# EAGLE design IR (EAGLE 9.6.2)
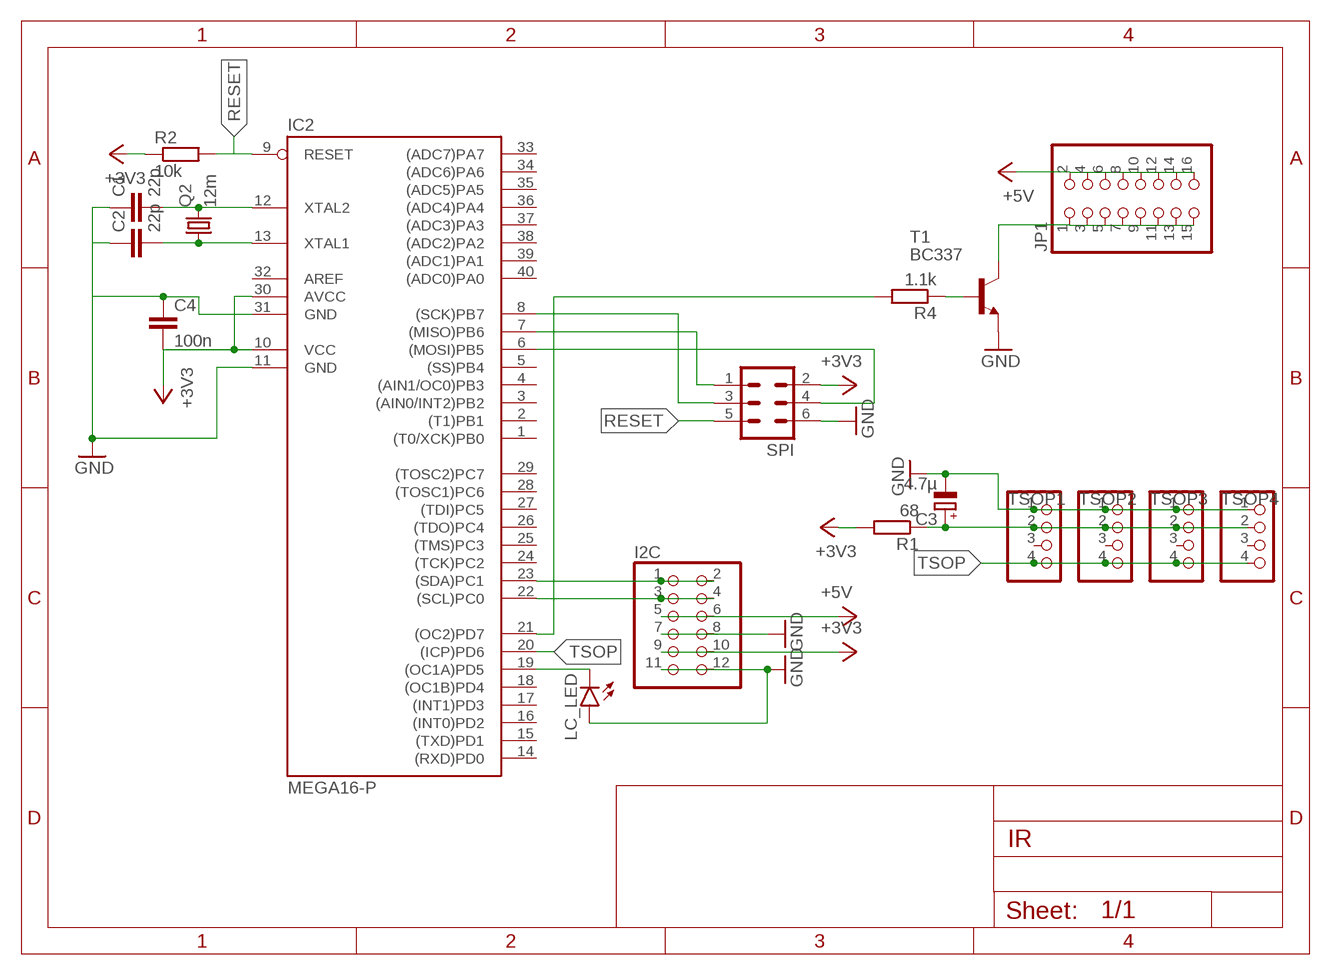
[diagram p0: schematic, sheet 1]

## Parts
C1  22p  C-EU025-025X050  [C025-025X050]
C2  22p  C-EU025-025X050  [C025-025X050]
C3  4.7µ  CPOL-EUE1.8-4  [E1,8-4]
C4  100n  C-EU025-025X050  [C025-025X050]
I2C  PINHD-2X6  [2X06]
IC2  MEGA16-P  [DIL40]
JP1  PINHD-2X8  [2X08]
LC_LED  LED5MM  [LED5MM]
Q2  12m  CRYSTALHC49S  [HC49/S]
R1  68  R-EU_0207/7  [0207/7]
R2  10k  R-EU_0207/7  [0207/7]
R4  1.1k  R-EU_0207/7  [0207/7]
SPI  ML6  [ML6]
T1  BC337  [TO92]
TSOP1  PINHD-1X4  [1X04]
TSOP2  PINHD-1X4  [1X04]
TSOP3  PINHD-1X4  [1X04]
TSOP4  PINHD-1X4  [1X04]

## Nets
+3V3: C4.2 I2C.9 I2C.10 IC2.10(VCC) IC2.30(AVCC) R1.2 R2.1 SPI.2
+5V: I2C.5 I2C.6 JP1.2 JP1.4 JP1.6 JP1.8 JP1.10 JP1.12 JP1.14 JP1.16
GND: C1.1 C2.1 C3.- C4.1 I2C.7 I2C.8 I2C.11 I2C.12 IC2.11(GND) IC2.31(GND) LC_LED.A SPI.6 T1.1(E) TSOP1.1 TSOP2.1 TSOP3.1 TSOP4.1
IO13: IC2.7((MISO)PB6) SPI.1
IO14: IC2.6((MOSI)PB5) SPI.4
N$1: C2.2 IC2.13(XTAL1) Q2.1
N$2: IC2.21((OC2)PD7) R4.2
N$3: R4.1 T1.2(B)
N$4: C1.2 IC2.12(XTAL2) Q2.2
N$5: JP1.1 JP1.3 JP1.5 JP1.7 JP1.9 JP1.11 JP1.13 JP1.15 T1.3(C)
N$6: IC2.19((OC1A)PD5) LC_LED.K(C)
N$9: IC2.8((SCK)PB7) SPI.3
RESET: IC2.9(RESET) R2.2 SPI.5
SCL: I2C.3 I2C.4 IC2.22((SCL)PC0)
SDA: I2C.1 I2C.2 IC2.23((SDA)PC1)
TSOP: IC2.20((ICP)PD6) TSOP1.4 TSOP2.4 TSOP3.4 TSOP4.4
TSOP_3_3: C3.+ R1.1 TSOP1.2 TSOP2.2 TSOP3.2 TSOP4.2
Unconnected: IC2.1((T0/XCK)PB0) IC2.2((T1)PB1) IC2.3((AIN0/INT2)PB2) IC2.4((AIN1/OC0)PB3) IC2.5((SS)PB4) IC2.14((RXD)PD0) IC2.15((TXD)PD1) IC2.16((INT0)PD2) IC2.17((INT1)PD3) IC2.18((OC1B)PD4) IC2.24((TCK)PC2) IC2.25((TMS)PC3) IC2.26((TDO)PC4) IC2.27((TDI)PC5) IC2.28((TOSC1)PC6) IC2.29((TOSC2)PC7) IC2.32(AREF) IC2.33((ADC7)PA7) IC2.34((ADC6)PA6) IC2.35((ADC5)PA5) IC2.36((ADC4)PA4) IC2.37((ADC3)PA3) IC2.38((ADC2)PA2) IC2.39((ADC1)PA1) IC2.40((ADC0)PA0) TSOP1.3 TSOP2.3 TSOP3.3 TSOP4.3

## Library data of the parts
C1 C2 C4 = rcl:C-EU: CAPACITOR, European symbol
C3 = rcl:CPOL-EU: POLARIZED CAPACITOR, European symbol
I2C = pinhead:PINHD-2X6: PIN HEADER
IC2 = atmel:MEGA16-P: MICROCONTROLLER 16 Kbytes FLASH 1 kbytes SRAM 512 bytes EEPROM USART 8-channel 10 bit ADC Source: avr.lbr; MPN: ATMEGA16-16PU; OC_FARNELL: 9171142; OC_NEWARK: 01M6885
JP1 = pinhead:PINHD-2X8: PIN HEADER
LC_LED = led:LED: LED OSRAM: - CHIPLED LG R971, LG N971, LY N971, LG Q971, LY Q971, LO R971, LY R971 LH N974, LH R974 LS Q976, LO Q976, LY Q976 LO Q996 - Hyper CHIPLED LW Q18S LB Q993, LB Q99A, LB R99A - SideLED LS A670, LO A670, LY A670, LG A670, LP A670 LB A673, LV A673, LT A673, LW A673 LH A674 LY A675 LS A676, LA A676, LO A676, LY A676, LW A676 LS A679, LY A679, LG A679 - Hyper Micro SIDELED® LS Y876, LA Y876, LO Y876, LY Y876 LT Y87S - SmartLED LW L88C, LW L88S LB L89C, LB L89S, LG L890 LS L89K, LO L89K, LY L89K LS L896, LA L896, LO L896, LY L896 - TOPLED LS T670, LO T670, LY T670, LG T670, LP T670 LSG T670, LSP T670, LSY T670, LOP T670, LYG T670 LG T671, LOG T671, LSG T671 LB T673, LV T673, LT T673, LW T673 LH T674 LS T676, LA T676, LO T676, LY T676, LB T676, LH T676, LSB T676, LW T676 LB T67C, LV T67C, LT T67C, LS T67K, LO T67K, LY T67K, LW E67C LS E67B, LA E67B, LO E67B, LY E67B, LB E67C, LV E67C, LT E67C LW T67C LS T679, LY T679, LG T679 LS T770, LO T770, LY T770, LG T770, LP T770 LB T773, LV T773, LT T773, LW T773 LH T774 LS E675, LA E675, LY E675, LS T675 LS T776, LA T776, LO T776, LY T776, LB T776 LHGB T686 LT T68C, LB T68C - Hyper Mini TOPLED® LB M676 - Mini TOPLED Santana® LG M470 LS M47K, LO M47K, LY M47K Source: http://www.osram.convergy.de LUXEON: - LUMILED® LXK2-PW12-R00, LXK2-PW12-S00, LXK2-PW14-U00, LXK2-PW14-V00 LXK2-PM12-R00, LXK2-PM12-S00, LXK2-PM14-U00 LXK2-PE12-Q00, LXK2-PE12-R00, LXK2-PE12-S00, LXK2-PE14-T00, LXK2-PE14-U00 LXK2-PB12-K00, LXK2-PB12-L00, LXK2-PB12-M00, LXK2-PB14-N00, LXK2-PB14-P00, LXK2-PB14-Q00 LXK2-PR12-L00, LXK2-PR12-M00, LXK2-PR14-Q00, LXK2-PR14-R00 LXK2-PD12-Q00, LXK2-PD12-R00, LXK2-PD12-S00 LXK2-PH12-R00, LXK2-PH12-S00 LXK2-PL12-P00, LXK2-PL12-Q00, LXK2-PL12-R00 Source: www.luxeon.com KINGBRIGHT: KA-3528ASYC Source: www.kingbright.com
Q2 = crystal:CRYSTAL: CRYSTAL; OC_FARNELL: 1667008; OC_NEWARK: unknown
R1 R2 R4 = resistor:R-EU_: RESISTOR, European symbol
SPI = con-ml:ML6: HARTING; OC_FARNELL: unknown; OC_NEWARK: unknown
T1 = transistor-neu-to92:BC337: NPN TRANSISTOR
TSOP1-TSOP4 = pinhead:PINHD-1X4: PIN HEADER

## Board
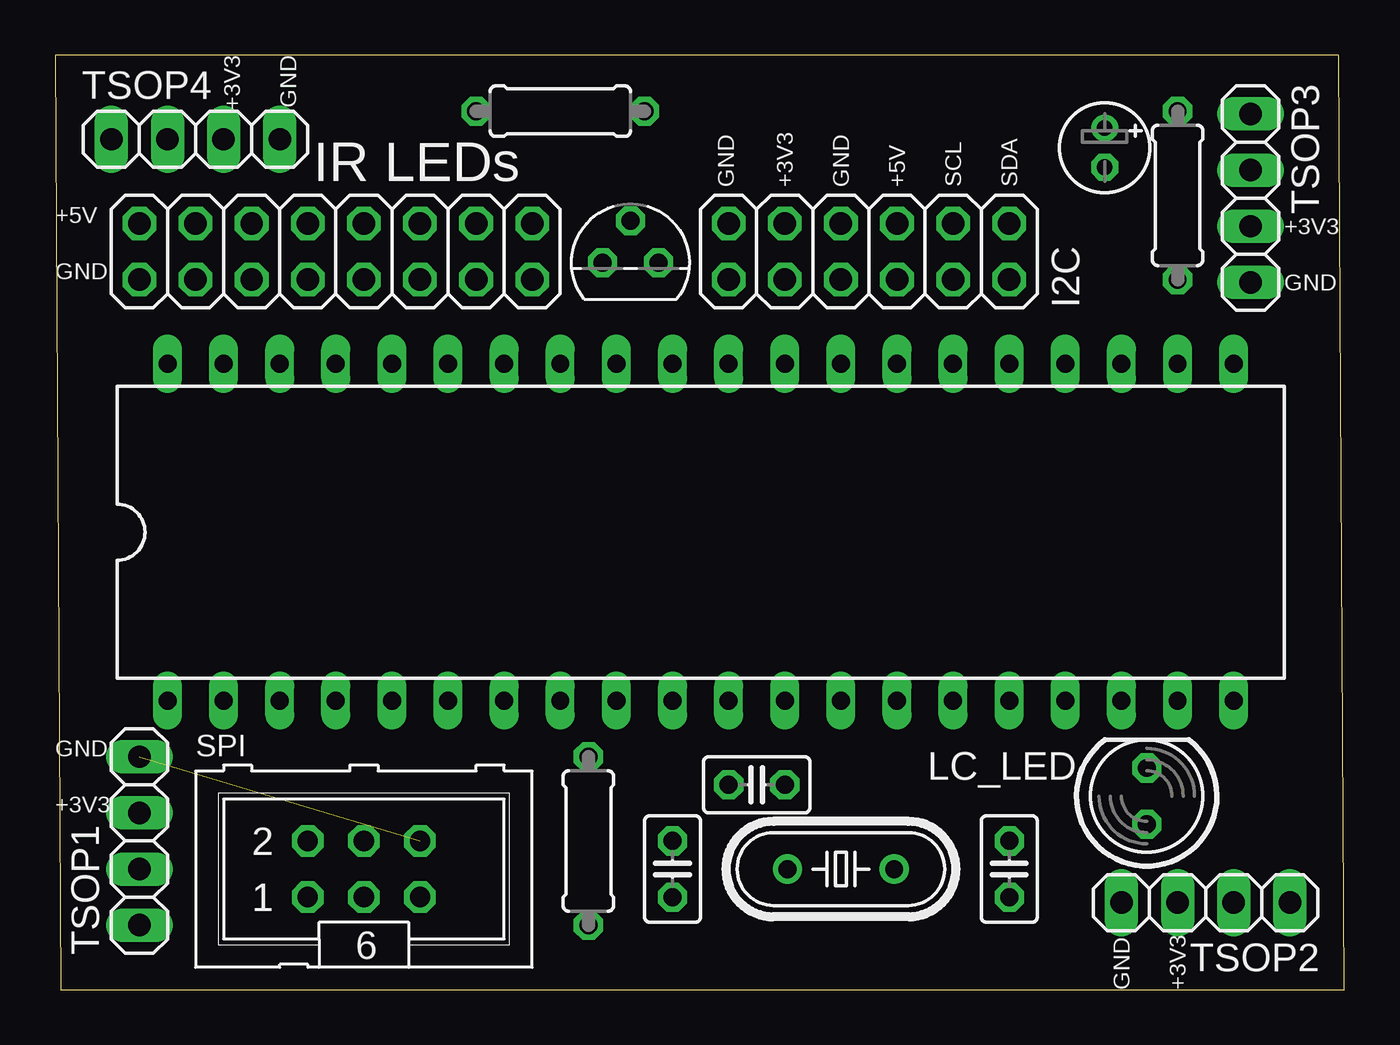
[diagram p1: board, top side]
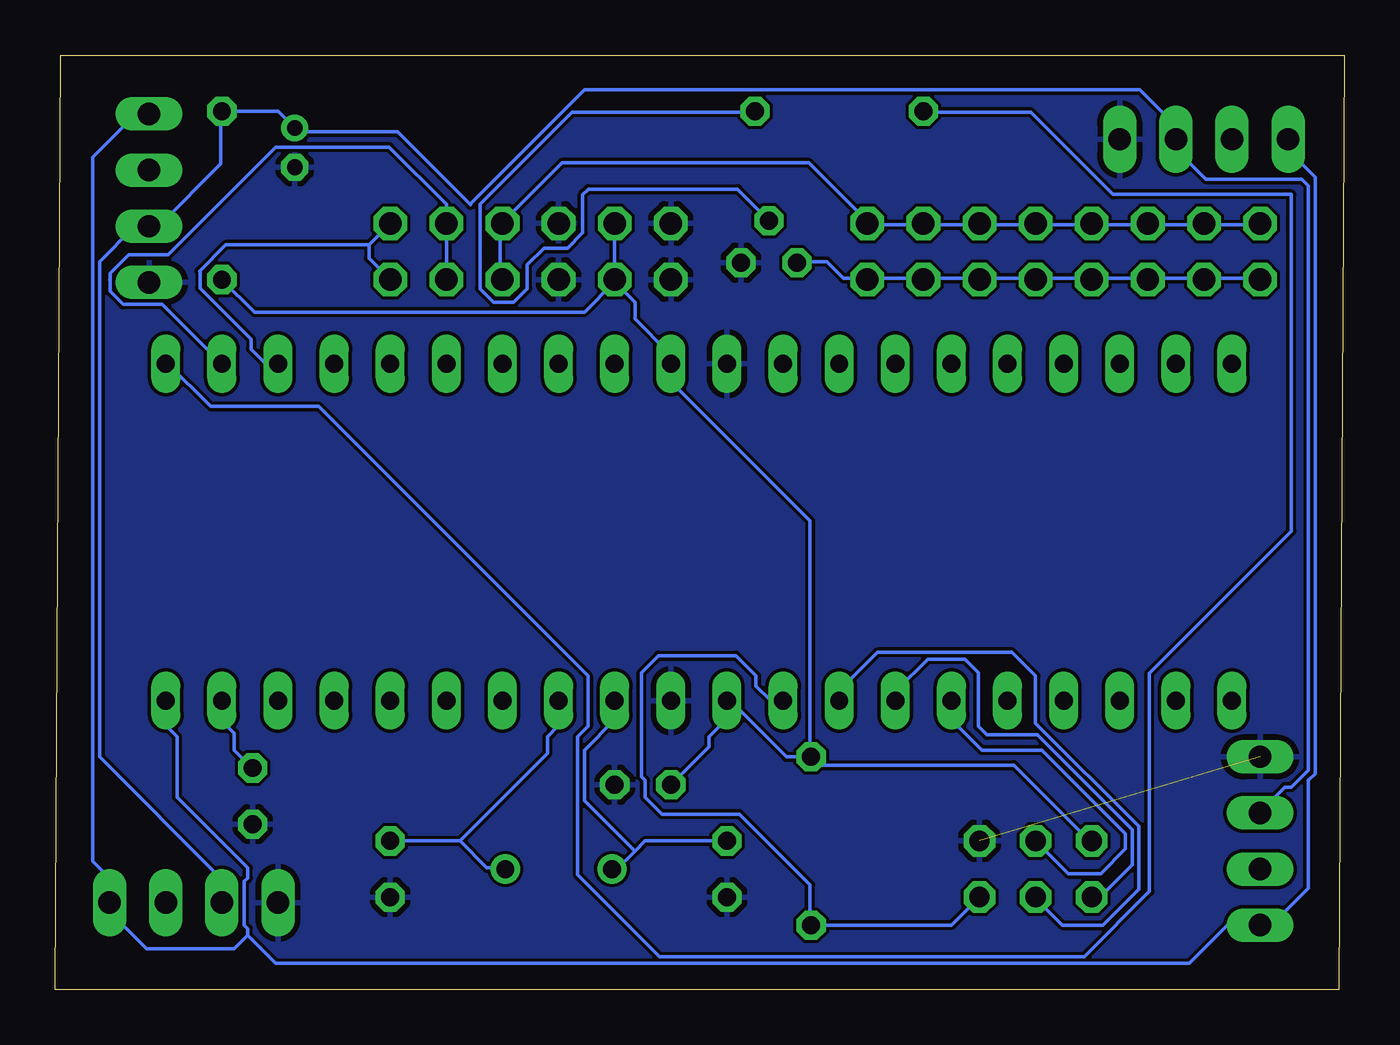
[diagram p2: board, bottom side, seen from below]

Size 58.34 x 42.28 mm. Coordinates in mm from the lower left corner, seen from the top.
Outline: 0.25,0 58.34,0 58.09,42.28 0,42.28 0.25,0
Copper layers (1*16): Top 0.035mm / dielectric 1.5mm / Bottom 0.035mm
Design rules "default": minimum track width 6mil, minimum drill 0.35mm, track to track 6mil, track to pad 6mil, pad to pad 6mil, via to via 6mil, smd to smd 6mil, copper to edge 40mil, drill to drill 6mil, minimum pad ring 10mil, minimum via ring 8mil, stop-mask expansion 4mil, vias tented up to drill 0mil, thermal gap 10mil

### Footprints (pad centres in the part's own frame; a part is rotated, then mirrored left to right if it is on the bottom)
C025-025X050 = drill 0.813 octagon: 1 -1.27,0; 2 1.27,0
E1,8-4 = drill 0.711 pad 1.168: + -0.889,0 | drill 0.711 pad 1.168 octagon: - 0.889,0
2X06 = drill 1.016 octagon: 1 -6.35,-1.27; 2 -6.35,1.27; 3 -3.81,-1.27; 4 -3.81,1.27; 5 -1.27,-1.27; 6 -1.27,1.27; 7 1.27,-1.27; 8 1.27,1.27; 9 3.81,-1.27; 10 3.81,1.27; 11 6.35,-1.27; 12 6.35,1.27
DIL40 = drill 0.813 long: 1 -24.13,-7.62; 2 -21.59,-7.62; 3 -19.05,-7.62; 4 -16.51,-7.62; 5 -13.97,-7.62; 6 -11.43,-7.62; 7 -8.89,-7.62; 8 -6.35,-7.62; 9 -3.81,-7.62; 10 -1.27,-7.62; 11 1.27,-7.62; 12 3.81,-7.62; 13 6.35,-7.62; 14 8.89,-7.62; 15 11.43,-7.62; 16 13.97,-7.62; 17 16.51,-7.62; 18 19.05,-7.62; 19 21.59,-7.62; 20 24.13,-7.62; 21 24.13,7.62; 22 21.59,7.62; 23 19.05,7.62; 24 16.51,7.62; 25 13.97,7.62; 26 11.43,7.62; 27 8.89,7.62; 28 6.35,7.62; 29 3.81,7.62; 30 1.27,7.62; 31 -1.27,7.62; 32 -3.81,7.62; 33 -6.35,7.62; 34 -8.89,7.62; 35 -11.43,7.62; 36 -13.97,7.62; 37 -16.51,7.62; 38 -19.05,7.62; 39 -21.59,7.62; 40 -24.13,7.62
2X08 = drill 1.016 octagon: 1 -8.89,-1.27; 2 -8.89,1.27; 3 -6.35,-1.27; 4 -6.35,1.27; 5 -3.81,-1.27; 6 -3.81,1.27; 7 -1.27,-1.27; 8 -1.27,1.27; 9 1.27,-1.27; 10 1.27,1.27; 11 3.81,-1.27; 12 3.81,1.27; 13 6.35,-1.27; 14 6.35,1.27; 15 8.89,-1.27; 16 8.89,1.27
LED5MM = drill 0.813 octagon: A -1.27,0; K 1.27,0
HC49/S = drill 0.813: 1 -2.413,0; 2 2.413,0
0207/7 = drill 0.813 octagon: 1 -3.81,0; 2 3.81,0
ML6 = drill 0.914 octagon: 1 -2.54,-1.27; 2 -2.54,1.27; 3 0,-1.27; 4 0,1.27; 5 2.54,-1.27; 6 2.54,1.27
TO92 = drill 0.813 octagon: 1 1.27,0; 2 0,1.905; 3 -1.27,0
1X04 = drill 1.016 long: 1 -3.81,0; 2 -1.27,0; 3 1.27,0; 4 3.81,0

### Placement (x,y rotation side)
C1  27.94,5.46 90 top
C2  43.18,5.46 90 top
C3  47.5,38.1 270 top
C4  31.75,9.27 180 top
I2C  36.83,33.4 180 top
IC2  29.21,20.7 0 top
JP1  12.7,33.4 0 top
LC_LED  49.4,8.76 90 top
Q2  35.56,5.46 180 top
R1  50.8,35.94 270 top
R2  24.13,6.73 270 top
R4  22.86,39.75 180 top
SPI  13.97,5.46 0 top
T1  26.03,32.89 0 top
TSOP1  3.81,6.73 270 top
TSOP2  52.07,3.94 0 top
TSOP3  54.1,35.81 90 top
TSOP4  6.35,38.48 180 top

### Tracks (layer width: path | path; a pad name or v marks a point on that pad's centre or on a via)
+3V3
  Bottom 0.152: 24.18,10.54 25.25,10.54 27.84,13.13 IC2.10 27.99,12.98 27.99,12.22 28.75,11.46 28.75,11 C4.2 | SPI.2 11.53,6.73 14.96,10.16 23.75,10.16 R2.1 24.18,10.54 | 33.02,32.03 32.11,31.11 32.11,30.35 30.58,28.83 30.58,28.37 IC2.30 30.43,28.22 30.43,27.46 24.18,21.21 24.18,10.54 | R1.2 49.33,30.66 34.39,30.66 33.02,32.03 | 33.02,32.03 I2C.10 I2C.9
+5V
  Bottom 0.152: 6.35,34.62 3.91,34.62 JP1.2 | 13.97,34.62 11.53,34.62 JP1.8 11.38,34.62 8.94,34.62 JP1.6 8.79,34.62 6.35,34.62 | 6.35,34.62 JP1.4 | I2C.6 38.2,32.18 38.2,34.62 I2C.5 38.05,34.77 35.41,37.41 24.23,37.41 21.59,34.77 JP1.16 21.59,34.62 19.15,34.62 JP1.14 19,34.62 16.56,34.62 JP1.12 16.41,34.62 13.97,34.62 | 13.97,34.62 JP1.10
GND  (1 unrouted)
  pour Bottom: 0,42.29 58.42,42.29 58.42,0 0,0
IO13
  Bottom 0.152: IC2.7 20.22,13.13 20.22,13.59 18.85,14.96 17.17,14.96 16.56,14.35 16.56,11.91 16.18,11.53 13.89,11.53 9.6,7.24 9.6,5.66 11.25,4.01 SPI.1
IO14
  Bottom 0.152: IC2.6 17.78,12.22 16.41,10.85 13.69,10.85 9.91,7.06 9.91,6.38 11.02,5.26 12.5,5.26 SPI.4
N$1
  Bottom 0.152: 40.03,6.73 38.81,5.51 38.05,5.51 Q2.1 | C2.2 40.03,6.73 | 40.03,6.73 36.07,10.69 36.07,11.46 35.61,11.91 35.61,12.98 IC2.13
N$2
  Bottom 0.152: R4.2 19.05,39.7 14.17,39.7 10.47,35.99 2.39,35.99 2.39,20.75 8.81,14.33 8.81,4.45 11.76,1.5 30.99,1.5 34.7,5.21 34.7,11.46 34.24,11.91 34.24,14.2 46.43,26.39 51.31,26.39 53.29,28.37 IC2.21
N$3
  Bottom 0.152: T1.2 27.46,36.22 34.21,36.22 34.47,35.97 34.47,34.24 35.15,33.55 36.22,33.55 36.98,32.79 36.98,31.72 37.59,31.11 38.51,31.11 39.12,31.72 39.12,35.53 34.95,39.7 26.67,39.7 R4.1
N$4
  Bottom 0.152: C1.2 31.65,6.73 32.11,6.27 | 32.11,6.27 33.02,5.36 Q2.2 | IC2.12 33.02,12.22 34.39,10.85 34.39,8.56 32.11,6.27
N$5
  Bottom 0.152: 21.59,32.18 22.66,32.18 23.42,32.94 24.64,32.94 T1.3 | 6.35,32.18 3.91,32.18 JP1.1 | 13.97,32.18 11.53,32.18 JP1.7 11.38,32.18 8.94,32.18 JP1.5 8.79,32.18 6.35,32.18 | 6.35,32.18 JP1.3 | 13.97,32.18 16.41,32.18 JP1.11 16.56,32.18 19,32.18 JP1.13 19.15,32.18 21.59,32.18 | 13.97,32.18 JP1.9 | 21.59,32.18 JP1.15
N$6
  Bottom 0.152: LC_LED.K 49.48,10.08 50.24,10.85 50.24,11.61 50.7,12.07 50.7,12.98 IC2.19
N$9
  Bottom 0.152: IC2.8 22.81,13.13 22.81,13.59 21.13,15.27 15.04,15.27 13.97,14.2 13.97,12.07 9.3,7.39 9.3,4.55 10.92,2.92 12.75,2.92 13.97,4.14 SPI.3
RESET
  Bottom 0.152: SPI.5 17.78,2.92 R2.2 24.18,2.92 24.18,4.75 27.38,7.95 30.89,7.95 31.65,8.71 31.65,9.47 31.8,9.63 31.8,14.35 31.04,15.11 27.53,15.11 26.62,14.2 26.62,13.74 26.01,13.13 25.4,13.13 IC2.9
SCL
  Bottom 0.152: I2C.4 I2C.3 40.64,35.53 43.23,38.12 48.36,38.12 53.24,33.25 55.02,33.25 55.86,32.41 55.86,32.16 55.88,32.13 55.86,32.11 55.86,31.59 55.27,31.01 53.49,31.01 IC2.22
SDA
  Bottom 0.152: 44.14,33.71 50.62,33.71 51.82,32.51 51.79,32.49 51.79,31.75 49.48,29.44 49.48,28.98 48.87,28.37 48.26,28.37 IC2.23 | I2C.1 44.14,33.71 | I2C.2 44.14,33.1 44.14,33.71
TSOP
  Bottom 0.152: 49.63,2.46 49.63,2.77 49.78,2.92 49.78,4.9 49.63,5.05 49.63,5.51 52.83,8.71 52.83,11.46 53.29,11.91 53.29,12.98 IC2.20 | 49.63,2.46 50.24,1.85 54.2,1.85 55.88,3.53 TSOP2.4 55.88,5.05 56.64,5.82 56.64,37.67 54.81,39.5 54.2,39.5 TSOP3.4 | 49.63,2.46 48.36,1.19 7.01,1.19 5.28,2.92 TSOP1.4 3.3,2.92 1.63,4.6 1.63,9.47 1.32,9.78 1.32,36.75 2.54,37.97 TSOP4.4
TSOP_3_3
  Bottom 0.152: TSOP1.2 3.76,8.1 2.69,9.17 2.39,9.17 1.63,9.93 1.63,36.37 1.93,36.68 6.27,36.68 7.57,37.97 7.57,38.43 TSOP4.2 7.72,38.58 7.72,39.19 9.25,40.72 34.39,40.72 39.57,35.53 | 39.57,35.53 42.85,38.81 47.32,38.81 C3.+ 48.26,39.75 R1.1 | 39.57,35.53 39.55,35.51 | 50.7,39.8 R1.1 | TSOP2.2 50.85,3.99 50.85,5.05 56.34,10.54 56.34,32.94 54.81,34.47 54.2,34.47 TSOP3.2 54.05,34.62 53.59,34.62 50.85,37.36 50.85,39.65 R1.1

### Text on the board
tPlace: GND | IR LEDs | +5V | GND | GND | GND | GND
tNames: +3V3 | GND | +3V3 | GND | +5V | SCL | SDA | +3V3 | +3V3 | +3V3